# EAGLE design boardV3 (EAGLE 6.4)

## Sheet 1 of 2
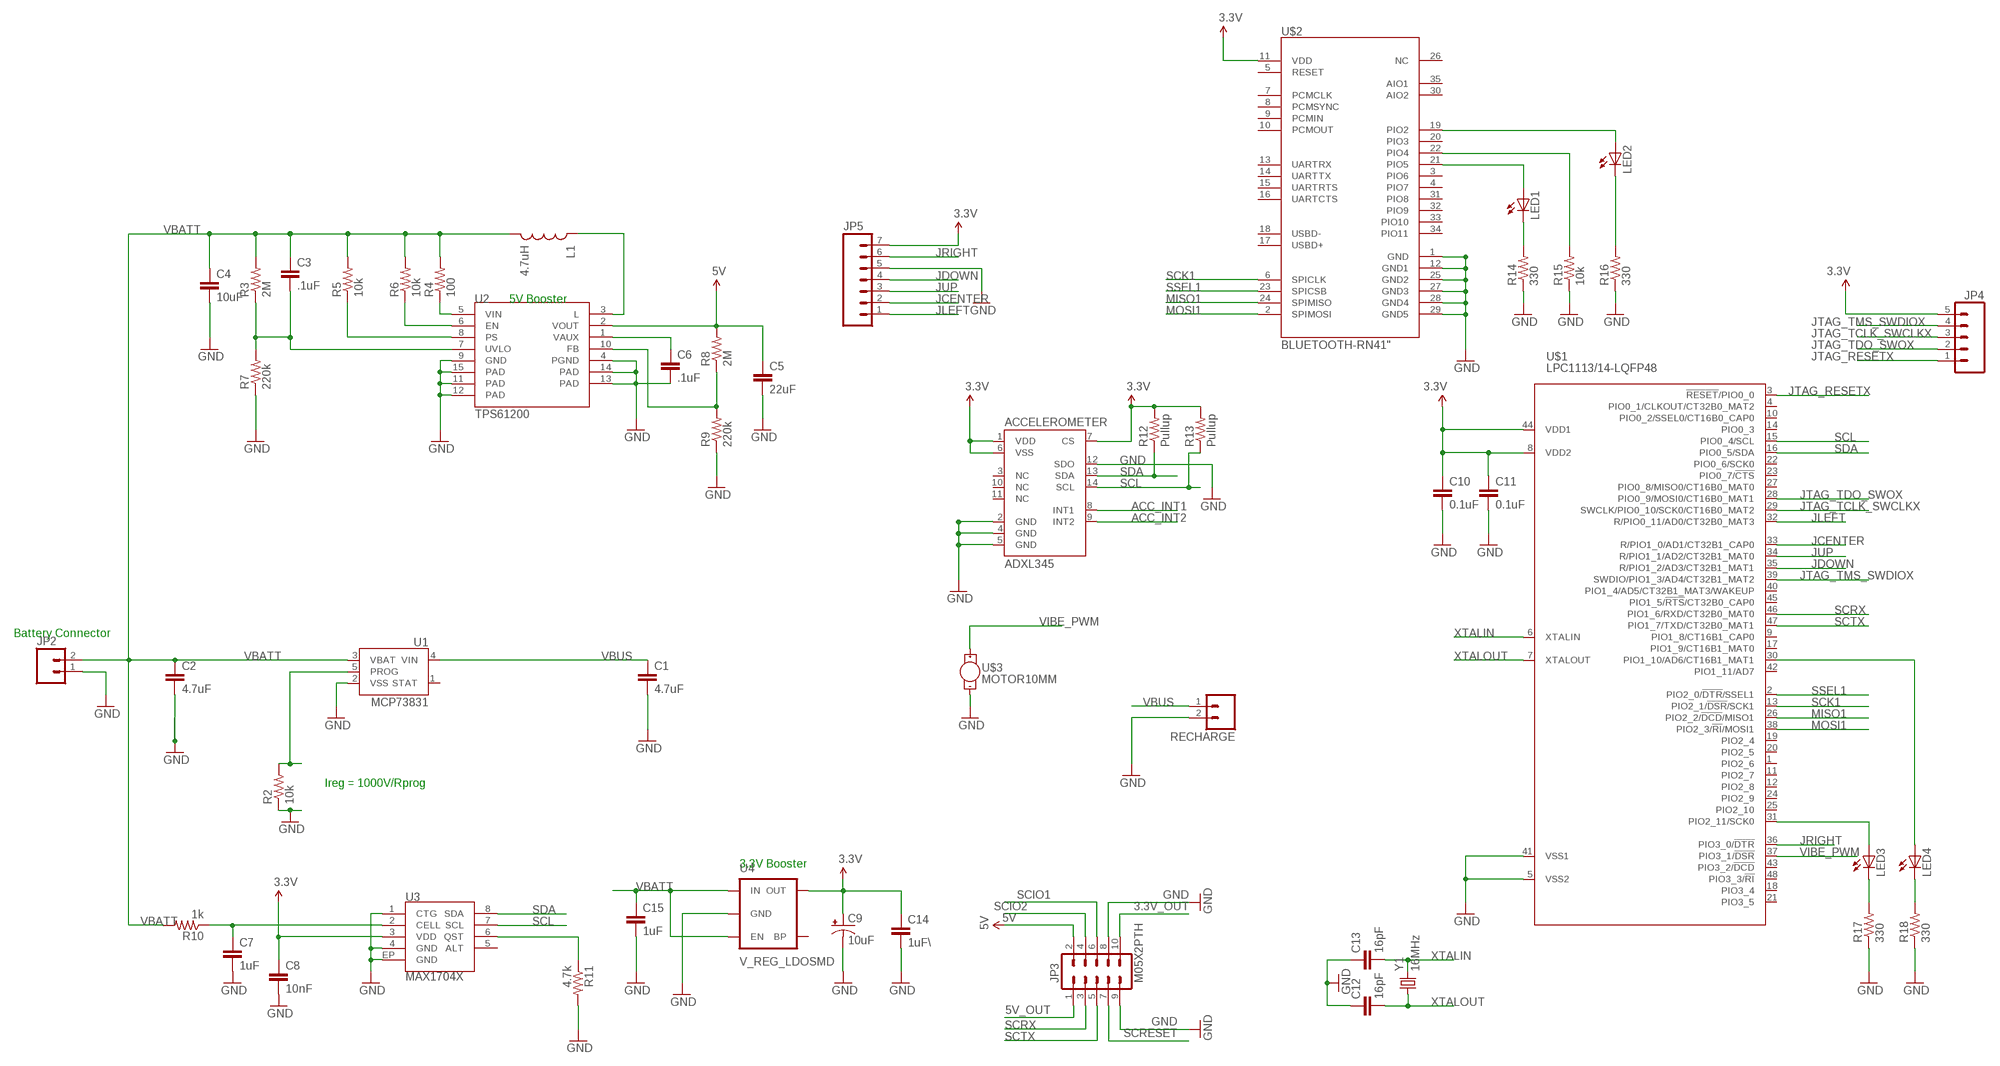
[diagram p0: schematic, sheet 1, part 1 of 2]
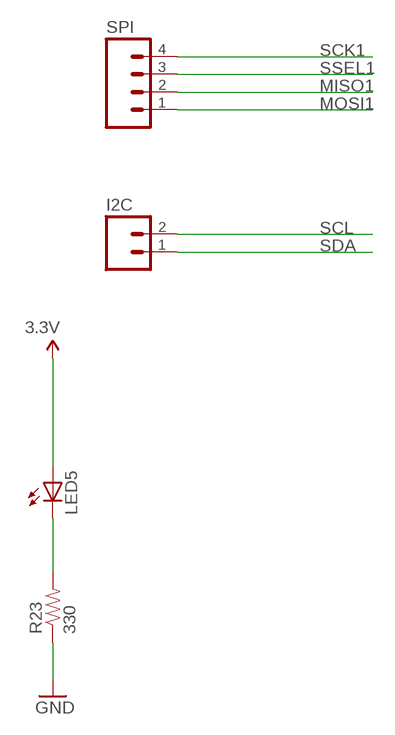
[diagram p1: schematic, sheet 1, part 2 of 2]

### Parts
ACCELEROMETER  ADXL345  [LGA14]
C1  4.7uF  CAP0603-CAP  [0603-CAP]
C2  4.7uF  CAP0603-CAP  [0603-CAP]
C3  .1uF  CAP0603-CAP  [0603-CAP]
C4  10uF  CAP0603-CAP  [0603-CAP]
C5  22uF  CAP0603-CAP  [0603-CAP]
C6  .1uF  CAP0603-CAP  [0603-CAP]
C7  1uF  CAP0603-CAP  [0603-CAP]
C8  10nF  CAP0603-CAP  [0603-CAP]
C9  10uF  10UF-TANT  [EIA3216]
C10  0.1uF  CAP0603-CAP  [0603-CAP]
C11  0.1uF  CAP0603-CAP  [0603-CAP]
C12  16pF  CAP0603-CAP  [0603-CAP]
C13  16pF  CAP0603-CAP  [0603-CAP]
C14  1uF\  CAP0603-CAP  [0603-CAP]
C15  1uF  CAP0603-CAP  [0603-CAP]
I2C  M02POLAR  [MOLEX-1X2]
JP2  M02PTH  [1X02]
JP3  M05X2PTH  [AVR_ICSP]
JP4  M05PTH  [1X05]
JP5  M07  [1X07]
L1  4.7uH  INDUCTOR.  [CDRH2D09]
LED1  LED0603  [LED-0603]
LED2  LED0603  [LED-0603]
LED3  LED0603  [LED-0603]
LED4  LED0603  [LED-0603]
LED5  LED0603  [LED-0603]
R2  10k  RESISTOR0603-RES  [0603-RES]
R3  2M  RESISTOR0603-RES  [0603-RES]
R4  100  RESISTOR0603-RES  [0603-RES]
R5  10k  RESISTOR0603-RES  [0603-RES]
R6  10k  RESISTOR0603-RES  [0603-RES]
R7  220k  RESISTOR0603-RES  [0603-RES]
R8  2M  RESISTOR0603-RES  [0603-RES]
R9  220k  RESISTOR0603-RES  [0603-RES]
R10  1k  RESISTOR0603-RES  [0603-RES]
R11  4.7k  RESISTOR0603-RES  [0603-RES]
R12  Pullup  RESISTOR0603-RES  [0603-RES]
R13  Pullup  RESISTOR0603-RES  [0603-RES]
R14  330  RESISTOR0603-RES  [0603-RES]
R15  10k  RESISTOR0603-RES  [0603-RES]
R16  330  RESISTOR0603-RES  [0603-RES]
R17  330  RESISTOR0603-RES  [0603-RES]
R18  330  RESISTOR0603-RES  [0603-RES]
R23  330  RESISTOR0603-RES  [0603-RES]
RECHARGE  M02POLAR  [MOLEX-1X2]
SPI  M04POLAR  [MOLEX-1X4]
U1  MCP73831  [SOT23-5]
U2  TPS61200  [QFN-10_PAD]
U3  MAX1704X  [TDFN-8]
U4  V_REG_LDOSMD  [SOT23-5]
U$1  LPC1113/14-LQFP48  [LQFP48]
U$2  BLUETOOTH-RN41"  [RN41]
U$3  MOTOR10MM  [VIBE-MOTOR-10MM]
Y1  16MHz  CRYSTAL5X3  [CRYSTAL-SMD-5X3]

### Nets
3.3V: ACCELEROMETER.1(VDD) ACCELEROMETER.6(VSS) ACCELEROMETER.7(CS) C8.1 C9.A(+) C10.1 C11.1 C14.1 JP4.5 JP5.7 LED5.A R12.2 R13.2 U3.3(VDD) U4.5(OUT) U$1.8(VDD2) U$1.44(VDD1) U$2.11(VDD) ; also sheet 2
3.3V_OUT: JP3.10
5V: C5.1 JP3.2 R8.2 U2.2(VOUT)
5V_OUT: JP3.1
ACC_INT1: ACCELEROMETER.8(INT1)
ACC_INT2: ACCELEROMETER.9(INT2)
GND: ACCELEROMETER.2(GND) ACCELEROMETER.4(GND) ACCELEROMETER.5(GND) ACCELEROMETER.12(SDO) C1.2 C2.2 C4.2 C5.2 C6.2 C7.2 C8.2 C9.C(-) C10.2 C11.2 C12.1 C13.1 C14.2 C15.2 JP2.1 JP3.8 JP3.9 JP5.5 R2.1 R7.1 R9.1 R11.2 R14.1 R15.1 R16.1 R17.1 R18.1 R23.1 RECHARGE.2 U1.2(VSS) U2.4(PGND) U2.9(GND) U2.11(PAD) U2.12(PAD) U2.13(PAD) U2.14(PAD) U2.15(PAD) U3.1(CTG) U3.4(GND) U3.EP(GND) U4.2(GND) U$1.5(VSS2) U$1.41(VSS1) U$2.1(GND) U$2.12(GND1) U$2.25(GND2) U$2.27(GND3) U$2.28(GND4) U$2.29(GND5) U$3.- ; also sheet 2
JCENTER: JP5.2 U$1.33(R/PIO1_0/AD1/CT32B1_CAP0) ; also sheet 2
JDOWN: JP5.4 U$1.35(R/PIO1_2/AD3/CT32B1_MAT1) ; also sheet 2
JLEFT: JP5.1 U$1.32(R/PIO0_11/AD0/CT32B0_MAT3) ; also sheet 2
JRIGHT: JP5.6 U$1.36(PIO3_0/!DTR!) ; also sheet 2
JTAG_RESETX: JP4.1 U$1.3(!RESET!/PIO0_0)
JTAG_TCLK_SWCLKX: JP4.3 U$1.29(SWCLK/PIO0_10/SCK0/CT16B0_MAT2)
JTAG_TDO_SWOX: JP4.2 U$1.28(PIO0_9/MOSI0/CT16B0_MAT1)
JTAG_TMS_SWDIOX: JP4.4 U$1.39(SWDIO/PIO1_3/AD4/CT32B1_MAT2)
JUP: JP5.3 U$1.34(R/PIO1_1/AD2/CT32B1_MAT0) ; also sheet 2
MISO1: SPI.2 U$1.26(PIO2_2/!DCD!/MISO1) U$2.24(SPIMISO)
MOSI1: SPI.1 U$1.38(PIO2_3/!RI!/MOSI1) U$2.2(SPIMOSI)
N$1: LED2.A U$2.19(PIO2)
N$2: R2.2 U1.5(PROG)
N$3: C3.2 R3.1 R7.2 U2.7(UVLO)
N$4: C6.1 U2.1(VAUX)
N$5: R6.1 U2.6(EN)
N$6: R5.1 U2.8(PS)
N$7: L1.P$1 U2.3(L)
N$8: R8.1 R9.2 U2.10(FB)
N$9: C7.1 R10.1 U3.2(CELL)
N$10: R11.1 U3.6(QST)
N$11: R15.2 U$2.22(PIO4)
N$12: LED1.A U$2.21(PIO5)
N$13: LED1.C R14.2
N$14: LED2.C R16.2
N$15: LED3.A U$1.31(PIO2_11/SCK0)
N$16: LED4.A U$1.30(PIO1_10/AD6/CT16B1_MAT1)
N$17: LED3.C R17.2
N$18: LED4.C R18.2
N$21: LED5.C R23.2
SCIO1: JP3.6
SCIO2: JP3.4
SCK1: SPI.4 U$1.13(PIO2_1/!DSR!/SCK1) U$2.6(SPICLK)
SCL: ACCELEROMETER.14(SCL) I2C.2 R13.1 U3.7(SCL) U$1.15(PIO0_4/SCL)
SCRESET: JP3.7
SCRX: JP3.3 U$1.46(PIO1_6/RXD/CT32B0_MAT0)
SCTX: JP3.5 U$1.47(PIO1_7/TXD/CT32B0_MAT1)
SDA: ACCELEROMETER.13(SDA) I2C.1 R12.1 U3.8(SDA) U$1.16(PIO0_5/SDA)
SSEL1: SPI.3 U$1.2(PIO2_0/!DTR!/SSEL1) U$2.23(SPICSB)
VBATT: C2.1 C3.1 C4.1 C15.1 JP2.2 L1.P$2 R3.2 R4.2 R5.2 R6.2 R10.2 U1.3(VBAT) U4.1(IN) U4.3(EN)
VBUS: C1.1 RECHARGE.1 U1.4(VIN)
VIBE_PWM: U$1.37(PIO3_1/!DSR!) U$3.+
VIN: R4.1 U2.5(VIN)
XTALIN: C13.2 U$1.6(XTALIN) Y1.3
XTALOUT: C12.2 U$1.7(XTALOUT) Y1.1
Unconnected: ACCELEROMETER.3(NC) ACCELEROMETER.10(NC) ACCELEROMETER.11(NC) U1.1(STAT) U3.5(ALT) U4.4(BP) U$1.1(PIO2_6) U$1.4(PIO0_1/CLKOUT/CT32B0_MAT2) U$1.9(PIO1_8/CT16B1_CAP0) U$1.10(PIO0_2/SSEL0/CT16B0_CAP0) U$1.11(PIO2_7) U$1.12(PIO2_8) U$1.14(PIO0_3) U$1.17(PIO1_9/CT16B1_MAT0) U$1.18(PIO3_4) U$1.19(PIO2_4) U$1.20(PIO2_5) U$1.21(PIO3_5) U$1.22(PIO0_6/SCK0) U$1.23(PIO0_7/!CTS!) U$1.24(PIO2_9) U$1.25(PIO2_10) U$1.27(PIO0_8/MISO0/CT16B0_MAT0) U$1.40(PIO1_4/AD5/CT32B1_MAT3/WAKEUP) U$1.42(PIO1_11/AD7) U$1.43(PIO3_2/!DCD!) U$1.45(PIO1_5/!RTS!/CT32B0_CAP0) U$1.48(PIO3_3/!RI!) U$2.3(PIO6) U$2.4(PIO7) U$2.5(RESET) U$2.7(PCMCLK) U$2.8(PCMSYNC) U$2.9(PCMIN) U$2.10(PCMOUT) U$2.13(UARTRX) U$2.14(UARTTX) U$2.15(UARTRTS) U$2.16(UARTCTS) U$2.17(USBD+) U$2.18(USBD-) U$2.20(PIO3) U$2.26(NC) U$2.30(AIO2) U$2.31(PIO8) U$2.32(PIO9) U$2.33(PIO10) U$2.34(PIO11) U$2.35(AIO1)

### Notes on the sheet
- 5V Booster
- Battery Connector
- Ireg = 1000V/Rprog
- 3.3V Booster

## Sheet 2 of 2
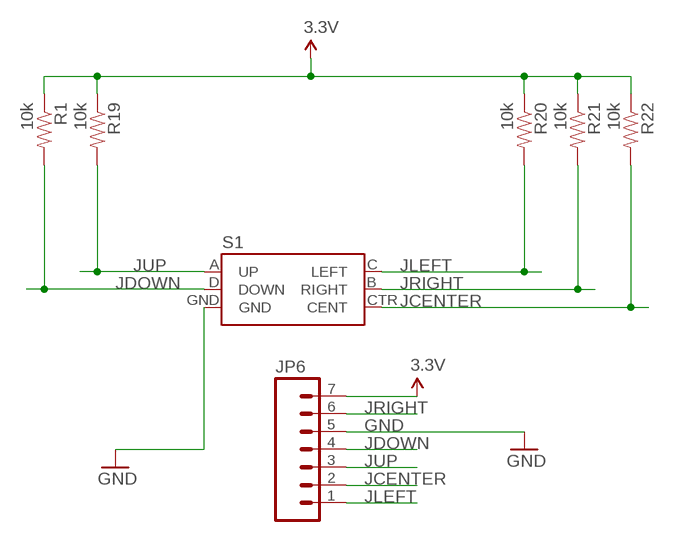
[diagram p2: schematic, sheet 2]

### Parts
JP6  M07  [1X07]
R1  10k  RESISTOR0603-RES  [0603-RES]
R19  10k  RESISTOR0603-RES  [0603-RES]
R20  10k  RESISTOR0603-RES  [0603-RES]
R21  10k  RESISTOR0603-RES  [0603-RES]
R22  10k  RESISTOR0603-RES  [0603-RES]
S1  JOYSTICK_MINI  [JOYSTICK_MINI]

### Nets
3.3V: JP6.7 R1.1 R19.1 R20.1 R21.1 R22.1 ; also sheet 1
GND: JP6.5 S1.GND ; also sheet 1
JCENTER: JP6.2 R22.2 S1.CTR(CENT) ; also sheet 1
JDOWN: JP6.4 R1.2 S1.D(DOWN) ; also sheet 1
JLEFT: JP6.1 R20.2 S1.C(LEFT) ; also sheet 1
JRIGHT: JP6.6 R21.2 S1.B(RIGHT) ; also sheet 1
JUP: JP6.3 R19.2 S1.A(UP) ; also sheet 1

## Library data of the parts
ACCELEROMETER = SparkFun-Sensors:ADXL345: 3-axis SPI/I2C 2/4/8/16g accelerometer
C1-C8 C10-C15 = SparkFun-Passives:CAP: Capacitor Standard 0603 ceramic capacitor, and 0.1" leaded capacitor.
C9 = SparkFun-Capacitors:10UF-TANT: 10uF Tantalum SMT CAP-00811- 16V 10% (EIA-3216); PROD_ID: CAP-00811
I2C JP2 RECHARGE = SparkFun-Connectors:M02: Header 2 Standard 2-pin 0.1" header. Use with straight break away headers (SKU : PRT-00116), right angle break away headers (PRT-00553), swiss pins (PRT-00743), machine pins (PRT-00117), and female headers (PRT-00115). Molex polarized connector foot print use with SKU : PRT-08233 with associated crimp pins and housings.
JP3 = SparkFun-Connectors:M05X2: Header 5x2 Standard 10-pin dual row 0.1" header. Commonly used with AVR-ISP. Use with Spark Fun Electronics SKU: PRT-00778
JP4 = SparkFun-Connectors:M05: Header 5 Standard 5-pin 0.1" header. Use with straight break away headers (SKU : PRT-00116), right angle break away headers (PRT-00553), swiss pins (PRT-00743), machine pins (PRT-00117), and female headers (PRT-00115). Molex polarized connector foot print use with SKU : PRT-08230 with associated crimp pins and housings.
JP5 JP6 = SparkFun-Connectors:M07: Header 7 Standard 7-pin 0.1" header. Use with straight break away headers (SKU : PRT-00116), right angle break away headers (PRT-00553), swiss pins (PRT-00743), machine pins (PRT-00117), and female headers (PRT-00115). NOTES ON THE VARIANTS LOCK and LOCK_LONGPADS... This footprint was designed to help hold the alignment of a through-hole component (i.e. 7-pin header) while soldering it into place. You may notice that each hole has been shifted either up or down by 0.005 of an inch from it's more standard position (which is usually a perfectly straight line). This slight alteration caused the pins (the squares in the middle) to touch the edges of the holes. Because they are alternating, it causes a "brace" to hold the header in place. 0.005 has proven to be the perfect amount of "off-center" position when using our standard breakaway headers. Although looks a little odd when you look at the bare footprint, once you have a header in there, the alteration is very hard to notice. Also, if you push a header all the way into place, it is covered up entirely on the bottom side. This idea of altering the position of holes to aid alignment will be further integrated into the Sparkfun Library for other footprints. It can help hold any component with 3 or more connection pins.
L1 = SparkFun-Passives:INDUCTOR: Inductors Basic Inductor/Choke - 0603 and 1206. Footprints are not proven and vary greatly between part numbers.
LED1-LED5 = SparkFun-LED:LED: LEDs Standard schematic elements and footprints for 5mm, 3mm, 1206, and 0603 sized LEDs. 5mm - Spark Fun Electronics SKU : COM-00529 (and others)
R1 R8 R9 R12 R13 R19-R22 = SparkFun-Resistors:RESISTOR: Resistor Basic schematic elements and footprints for 0603, 1206, and PTH resistors.
R2-R7 R10 R11 R14-R18 R23 = SparkFun-Passives:RESISTOR: Resistor Basic schematic elements and footprints for 0603, 1206, and PTH resistors.
S1 = SparkFun-Electromechanical:JOYSTICK_MINI: Small 5-way tactile joystick, COM-10063 4UCON SF303GJ26
SPI = SparkFun-Connectors:M04: Header 4 Standard 4-pin 0.1" header. Use with straight break away headers (SKU : PRT-00116), right angle break away headers (PRT-00553), swiss pins (PRT-00743), machine pins (PRT-00117), and female headers (PRT-00115). Molex polarized connector foot print use with SKU : PRT-08231 with associated crimp pins and housings. 1MM SMD Version SKU: PRT-10208
U1 = SparkFun-PowerIC:MCP73831: Miniature single cell, fully integrated Li-Ion, Li-polymer charge management controller http://ww1.microchip.com/downloads/en/DeviceDoc/21984a.pdf IC-09995; PROD_ID: IC-09995
U2 = SparkFun-PowerIC:TPS61200: DC to DC Booster IC-10035; PROD_ID: IC-10035
U3 = SparkFun-PowerIC:MAX1704X: MAX17043/MAX17044: Battery Fuel Guage (43 is 1cell, 44 is 2cell)
U4 = SparkFun-PowerIC:V_REG_LDO: Voltage Regulator LDO Standard 150mA LDO voltage regulator in SOT-23 layout. Micrel part MIC5205. BP (by-pass) pin is used to lower output noise with 470pF cap.
U$1 = lpc1100v1.1:LPC1113/14-LQFP48: NXP Semiconductors LPC11xx microcontrollers <http://ics.nxp.com/products/lpc1000/lpc11xx/> ARM 32-bit Cortex-M0 Microcontroller with MPU CPU clock up to 50MHz Up to 32KByte on-chip Flash ROM with In-System Programming (ISP) and In-Application Programming (IAP) via On-Chip Bootloader Up to 8KByte SRAM Nested Vectored Interrupt Controller Up to 2 SPI controllers UART with full Modem Interface and RS485 Support Fast Mode I2C-Bus 4 Timers with 4 capture channels and 13 output channels Watchdog (WDT) Sytem tick timer 10-bit ADC with 8 channels Power Management Unit (PMU) Brownout detection 12MHz internal RC oscillator Serial Wire Debug/Trace port
U$2 = SparkFun-RF:BLUETOOTH-RN41: Bluetooth SMD module
U$3 = SparkFun-Electromechanical:MOTOR: Vibration Motor- ROB-08449 Physical dimension and wire connections for this powerful vibration motor. Motor has a self adhesive backing.
Y1 = SparkFun-FreqCtrl:CRYSTAL: Various standard crystals. Proven footprints. Spark Fun Electronics SKU : COM-00534

## Board
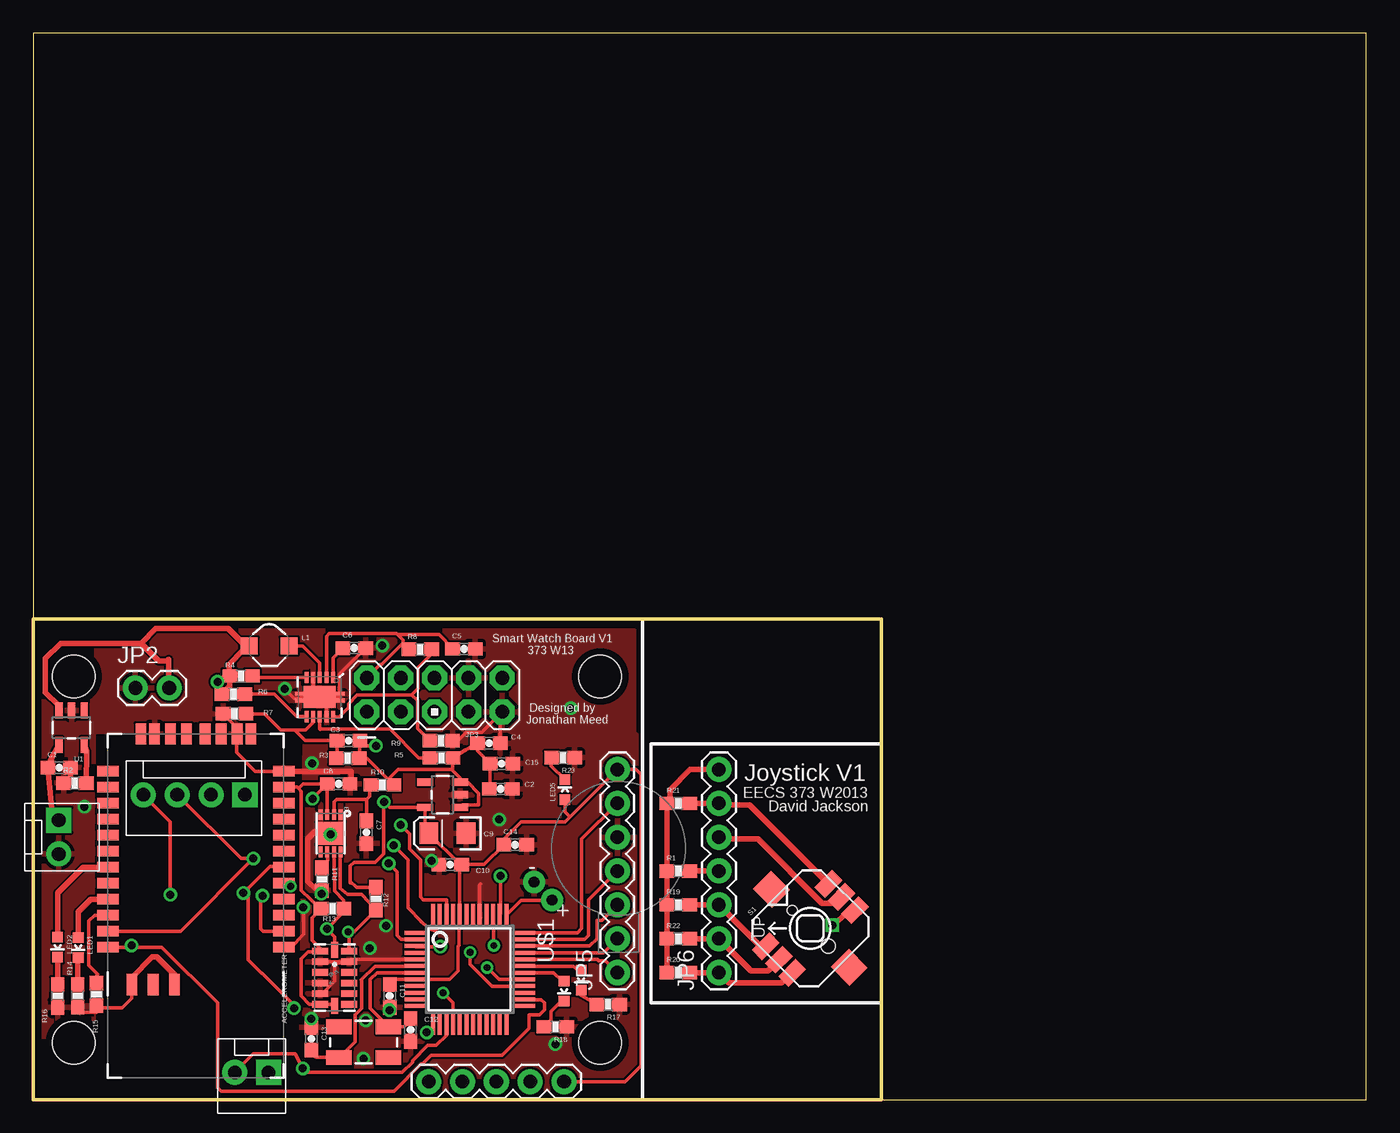
[diagram p3: board, top side]
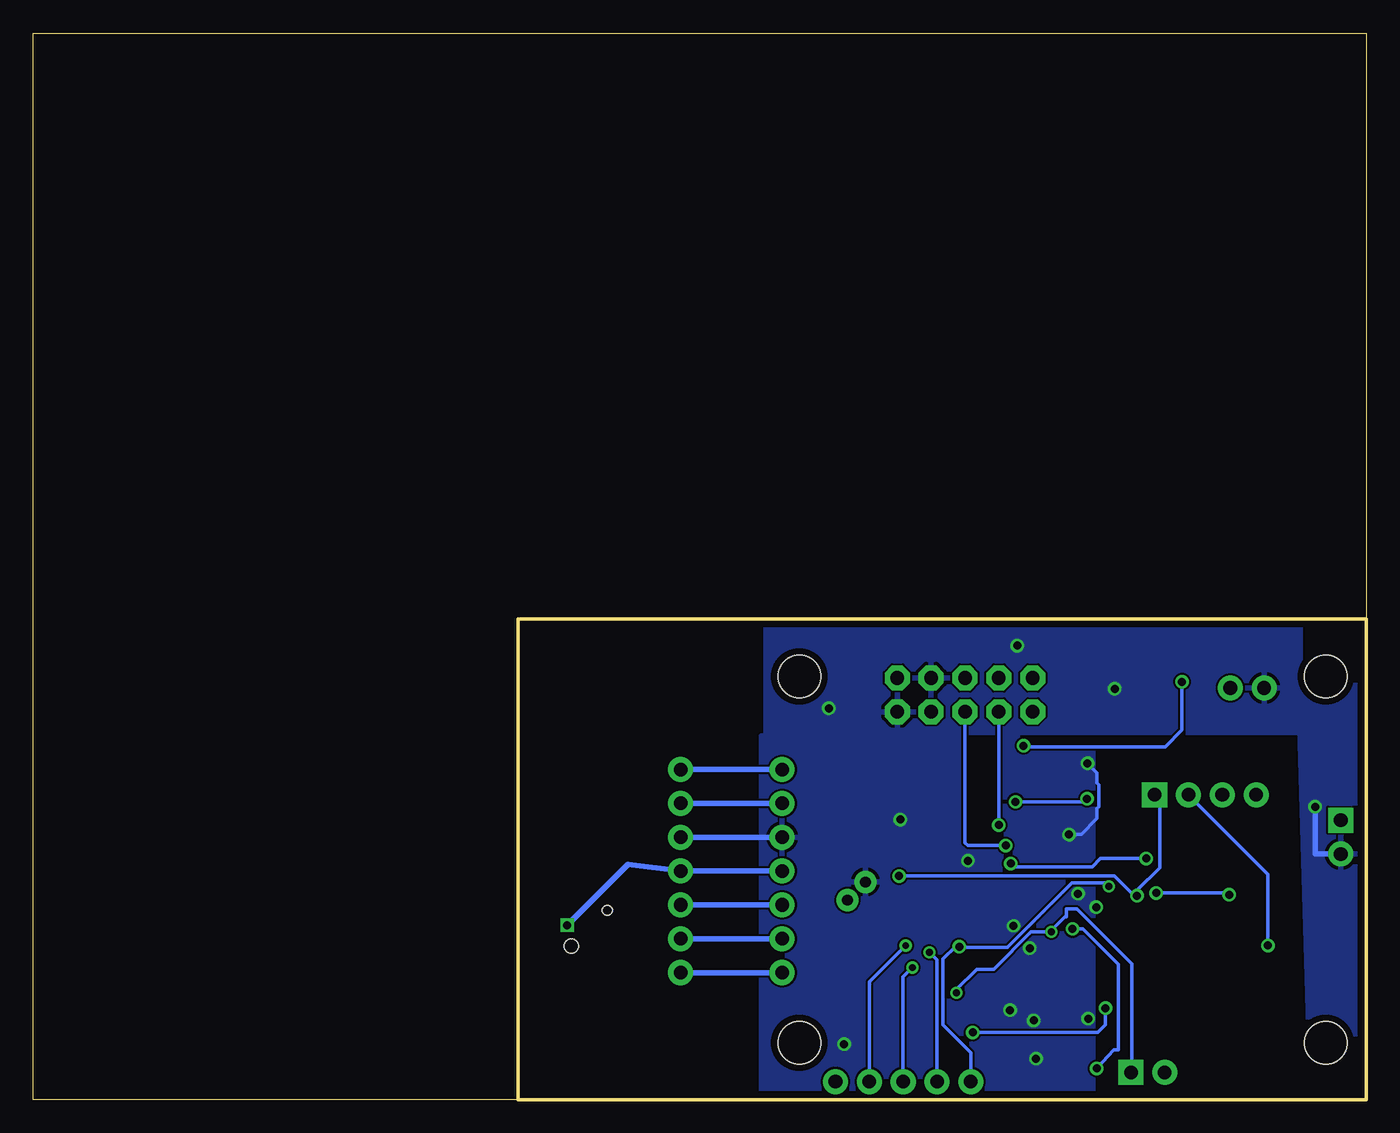
[diagram p4: board, bottom side, seen from below]

Size 100 x 80 mm. Coordinates in mm from the lower left corner, seen from the top.
Outline: 63.5,0 63.47,0 0,0 0,36.07
Outline: 63.5,0 100,0 100,80 0,80 0,36.07
Outline: 0,36.07 63.47,36.07
Outline: 63.5,0 63.63,0 63.63,36.07
Copper layers (1*16): Top 0.0178mm / dielectric 59mil / Bottom 0.0178mm
Design rules "default": minimum track width 6mil, minimum drill 14mil, track to track 6mil, track to pad 6mil, pad to pad 6mil, via to via 6mil, smd to smd 6mil, copper to edge 20mil, drill to drill 16mil, minimum pad ring 8mil, minimum via ring 8mil, stop-mask expansion 3mil, vias tented up to drill 0mil, thermal gap 10mil
Holes 3.2 mm at 42.53,31.75 3.03,31.75 3.03,4.25 42.53,4.25

### Footprints (pad centres in the part's own frame; a part is rotated, then mirrored left to right if it is on the bottom)
LGA14 = smd 0.5 x 1.2: 1 2,1.1; 2 1.2,1.1; 3 0.4,1.1; 4 -0.4,1.1; 5 -1.2,1.1; 6 -2,1.1; 8 -2,-1.1; 9 -1.2,-1.1; 10 -0.4,-1.1; 11 0.4,-1.1; 12 1.2,-1.1; 13 2,-1.1 | smd 1.2 x 0.5: 7 -2.1,0; 14 2.1,0
0603-CAP = smd 1.1 x 1: 1 -0.85,0; 2 0.85,0
EIA3216 = smd 1.4 x 1.6: A 1.4,0; C -1.4,0
MOLEX-1X2 = drill 1.016 pad 1.88 square: 1 0,0 | drill 1.016 pad 1.88: 2 2.54,0
1X02 = drill 1.016 pad 1.88: 1 0,0; 2 2.54,0
AVR_ICSP = drill 1.016 pad 1.88 octagon: 1 -1.27,5.08; 2 1.27,5.08; 3 -1.27,2.54; 4 1.27,2.54; 5 -1.27,0; 6 1.27,0; 7 -1.27,-2.54; 8 1.27,-2.54; 9 -1.27,-5.08; 10 1.27,-5.08
1X05 = drill 1.016 pad 1.88: 1 0,0; 2 2.54,0; 3 5.08,0; 4 7.62,0; 5 10.16,0
1X07 = drill 1.016 pad 1.88: 1 0,0; 2 2.54,0; 3 5.08,0; 4 7.62,0; 5 10.16,0; 6 12.7,0; 7 15.24,0
CDRH2D09 = smd 1.3 x 1.3: P$1 -1.5,0; P$2 1.5,0
LED-0603 = smd 0.8 x 0.8: A 0,-0.75; C 0,0.75
0603-RES = smd 1.1 x 1: 1 -0.85,0; 2 0.85,0
JOYSTICK_MINI = smd 1.85 x 1.1: A -3.325,1.4; B 3.325,1.4; C -3.325,-1.4; CTR -3.325,0; D 3.325,-1.4; GND 3.325,0 | smd 1.9 x 2: NC 0,4.13; NC@0 0,-4.13 | hole 0.75: 0,1.9 | hole 1.05: 0,-1.9
MOLEX-1X4 = drill 1.016 pad 1.88 square: 1 0,0 | drill 1.016 pad 1.88: 2 2.54,0; 3 5.08,0; 4 7.62,0
SOT23-5 = smd 0.55 x 1.2: 1 -0.95,-1.3; 2 0,-1.3; 3 0.95,-1.3; 4 0.95,1.3; 5 -0.95,1.3
QFN-10_PAD = smd 0.297 x 0.85: 1 -1,-1.475; 2 -0.5,-1.475; 3 0,-1.475; 4 0.5,-1.475; 5 1,-1.475; 6 1,1.475; 7 0.5,1.475; 8 0,1.475; 9 -0.5,1.475; 10 -1,1.475 | smd 0.7 x 0.28: 11 -1.5,0.25; 12 -1.5,-0.25; 13 1.5,0.25; 14 1.5,-0.25 | smd 2.4 x 1.65: 15 0,0
TDFN-8 = smd 0.8 x 0.3: 1 -1.4,0.75; 2 -1.4,0.25; 3 -1.4,-0.25; 4 -1.4,-0.75; 5 1.4,-0.75; 6 1.4,-0.25; 7 1.4,0.25; 8 1.4,0.75 | smd 1.73 x 1.88: EP 0,0
LQFP48 = smd 0.3 x 1.6: 1 -2.75,-4.1; 2 -2.25,-4.1; 3 -1.75,-4.1; 4 -1.25,-4.1; 5 -0.75,-4.1; 6 -0.25,-4.1; 7 0.25,-4.1; 8 0.75,-4.1; 9 1.25,-4.1; 10 1.75,-4.1; 11 2.25,-4.1; 12 2.75,-4.1; 25 2.75,4.1; 26 2.25,4.1; 27 1.75,4.1; 28 1.25,4.1; 29 0.75,4.1; 30 0.25,4.1; 31 -0.25,4.1; 32 -0.75,4.1; 33 -1.25,4.1; 34 -1.75,4.1; 35 -2.25,4.1; 36 -2.75,4.1 | smd 1.6 x 0.3: 13 4.1,-2.75; 14 4.1,-2.25; 15 4.1,-1.75; 16 4.1,-1.25; 17 4.1,-0.75; 18 4.1,-0.25; 19 4.1,0.25; 20 4.1,0.75; 21 4.1,1.25; 22 4.1,1.75; 23 4.1,2.25; 24 4.1,2.75; 37 -4.1,2.75; 38 -4.1,2.25; 39 -4.1,1.75; 40 -4.1,1.25; 41 -4.1,0.75; 42 -4.1,0.25; 43 -4.1,-0.25; 44 -4.1,-0.75; 45 -4.1,-1.25; 46 -4.1,-1.75; 47 -4.1,-2.25; 48 -4.1,-2.75
RN41 = smd 0.8 x 1.6: 1 -6.6,-6.6; 2 -5.4,-6.6; 3 -4.2,-6.6; 4 -3,-6.6; 5 -1.8,-6.6; 6 -0.6,-6.6; 7 0.6,-6.6; 8 1.8,-6.6; 9 3,-6.6; 10 4.2,-6.6; 11 5.4,-6.6; 12 6.6,-6.6; 13 6.6,6.6; 14 5.4,6.6; 15 4.2,6.6; 16 3,6.6; 17 1.8,6.6; 18 0.6,6.6; 19 -0.6,6.6; 20 -1.8,6.6; 21 -3,6.6; 22 -4.2,6.6; 23 -5.4,6.6; 24 -6.6,6.6 | smd 1.6 x 0.8: 25 -9.4,4.8; 26 -9.4,3.2; 27 -9.4,1.6; 28 9.4,3.1; 29 9.4,-3.1; 30 9.4,-4.122; 31 9.4,-1.9; 32 9.4,-0.7; 33 9.4,0.7; 34 9.4,1.9; 35 9.4,4.122
VIBE-MOTOR-10MM = drill 0.8 pad 1.676: + -5,-3.9; - -6.35,-2.54
CRYSTAL-SMD-5X3 = smd 1.9 x 1.1: 1 -1.85,-1.15; 2 1.85,-1.15; 3 1.85,1.15; 4 -1.85,1.15

### Placement (x,y rotation side)
ACCELEROMETER  22.61,9.15 90 top
C1  1.95,24.9 0 top
C2  35.07,23.3 0 top
C3  23.64,26.93 180 top
C4  34.18,26.73 0 top
C5  32.31,33.8 0 top
C6  24.09,33.87 0 top
C7  24.98,20.06 270 top
C8  22.9,23.68 0 top
C9  31.07,19.98 180 top
C10  31.28,17.63 180 top
C11  26.74,7.77 270 top
C12  28.3,5.22 90 top
C13  20.87,4.57 270 top
C14  36.16,19.11 0 top
C15  35.12,25.2 0 top
I2C  17.65,2.03 180 top
JP2  7.65,30.88 0 top
JP3  30.1,30.36 90 top
JP4  29.66,1.35 0 top
JP5  43.81,9.53 90 top
JP6  51.44,9.53 90 top
L1  17.69,34.03 180 top
LED1  3.36,11.41 180 top
LED2  1.82,11.44 180 top
LED3  41.1,8.97 180 top
LED4  39.82,8.14 180 top
LED5  39.88,23.24 0 top
R1  48.39,17.14 0 top
R2  3.12,23.74 0 top
R3  23.59,25.61 0 top
R4  15.59,31.78 180 top
R5  30.62,25.63 0 top
R6  15.01,30.41 180 top
R7  15.09,28.94 0 top
R8  29.03,33.78 180 top
R9  30.59,26.92 180 top
R10  26.19,23.6 0 top
R11  21.66,16.53 270 top
R12  25.71,15.06 90 top
R13  22.45,14.32 180 top
R14  3.33,7.79 90 top
R15  4.74,7.9 90 top
R16  1.83,7.77 90 top
R17  43.13,7.13 180 top
R18  39.17,5.46 180 top
R19  48.39,14.61 0 top
R20  48.39,9.53 0 top
R21  48.39,22.23 0 top
R22  48.39,12.06 0 top
R23  39.75,25.65 180 top
RECHARGE  1.91,20.95 270 top
S1  58.29,12.85 45 top
SPI  15.88,22.86 180 top
U1  2.86,27.9 180 top
U2  21.49,30.19 180 top
U3  22.31,19.98 270 top
U4  30.71,22.87 90 top
U$1  32.74,9.76 270 top
U$2  12.19,18.03 90 top
U$3  43.92,18.86 0 top
Y1  24.78,4.31 180 top

### Tracks (layer width: path | path; a pad name or v marks a point on that pad's centre or on a via)
3.3V  (via drill 0.6)
  Top 0.254: ACCELEROMETER.7 22.51,7.14 ACCELEROMETER.6 20.7,7.14 20.08,7.77 20.08,10.54 20.61,11.06 21.43,11.06 ACCELEROMETER.1 | ACCELEROMETER.1 21.51,11.06 21.55,11.01 | ACCELEROMETER.1 21.51,11.35 20.92,11.94 20.92,13.65 R13.2 21.48,14.32 20.79,15.02 | 19.89,23.34 20.11,23.13 20.11,15.7 20.79,15.02 | 19.89,23.34 19.79,23.45 18.81,23.45 U$2.11 | C8.1 U3.3 | C8.1 20.23,23.68 19.89,23.34 | v20.95,22.57 v20.95,22.58 C8.1 | C9.A 29.41,20.24 U4.5 26.72,21.92 v26.31,22.33 26.27,22.29 26.27,18.42 25.64,17.79 24.06,17.79 23.79,17.52 23.79,16.38 | 30,19.65 C9.A | C10.1 32.2,17.63 | 32.2,17.63 32.2,17.62 | C10.1 32.02,17.63 C9.A | 23.79,16.26 23.79,16.38 | C11.1 27.13,9.01 U$1.8 31.24,9.01 31.88,9.65 31.88,11.5 31.95,11.57 31.95,13.82 U$1.44 31.99,17.49 C10.1 | 32.2,17.63 33.82,17.63 C14.1 35.31,19.56 36.58,20.83 39.88,20.83 40.26,21.21 | 40.26,21.21 JP5.7 45.21,24.77 45.59,24.38 45.59,2.54 44.4,1.35 JP4.5 | LED5.A 39.88,21.59 40.26,21.21 | 20.79,15.02 | R12.2 24.25,15.91 23.79,16.38
  Top 0.406: JP6.7 49.28,24.77 47.75,23.24 47.75,22.44 R21.1 R1.1 R19.1 R22.1 R20.1
  Bottom 0.254: v26.31,22.33 21.18,22.33 v20.95,22.57
  Bottom 0.406: JP5.7 JP6.7
5V
  Top 0.254: U2.2 21.99,34.76 22.2,34.97 27.27,34.97 27.38,34.85 | 27.38,34.85 27.75,34.48 27.75,34.27 27.59,34.11 | 27.59,34.11 26.12,32.64 26.03,32.64 JP3.2 | R8.2 27.93,33.78 27.59,34.11 | C5.1 31.46,33.86 30.44,34.88 27.41,34.88 27.38,34.85
GND  (via drill 0.6)
  Top 0.254: ACCELEROMETER.5 21.67,7.95 22.61,8.88 22.61,10.14 22.71,10.25 23.61,10.25 ACCELEROMETER.12 | ACCELEROMETER.12 ACCELEROMETER.2 | 18.79,25.01 U$2.12 16.64,24.63 15.24,26.04 15.24,27.38 U$2.29 15.53,27.68 15.51,27.68 R7.1 | U$1.5 23.88,10.51 ACCELEROMETER.12 | U$2.25 7.39,7.59 6.67,6.87 4.92,6.87 R15.1 4.74,6.54 3.33,6.54 R14.1 3.65,6.62 | U$2.1 19.34,11.43 20.29,12.38 20.29,14.38 v20.25,14.43 | 33.49,13.75 U$1.41 33.49,16.11 33.54,16.16 | 33.49,13.75 33.51,13.73 | 33.49,13.75 33.49,13.69 33.55,13.63 | U2.12 22.99,31.93 C6.2 | C4.2 35.03,28.94 JP3.9 33.65,27.56 32.48,27.56 31.84,26.92 R9.1 | U2.4 20.99,30.69 | U2.9 21.99,29.95 21.84,30.1 19.56,30.1 18.92,30.73 18.8,30.73 | C11.2 26.74,6.72 v26.72,6.7
  Top 0.406: U$2.25 7.39,9.14 8.94,10.69 9.26,10.69 10.63,9.32 10.63,8.68 U$2.27 | 3.44,7.03 R14.1 | C1.2 2.75,23.78 R2.1 | U$2.12 23.82,24.63 23.83,24.63 23.83,23.76 C8.2 | 20.99,30.69 U2.15 | U2.15 20.24,30.19 U2.13 | U2.15 22.74,30.19 U2.12 | JP6.5 51.44,19.56 54.36,19.56 59.18,14.73 60.18,14.73 S1.GND | R11.2 21.28,15.68 20.57,16.38 20.57,19.56 21.14,20.13 22.16,20.13 U3.EP
  Bottom 0.254: v22.3,19.89 21.39,19.89 20.19,21.08 20.19,21.84 20.07,21.97 20.07,23.62 20.19,23.75 20.19,24.51 v20.9,25.22
  Bottom 0.406: JP5.5 JP6.5 | RECHARGE.2 3.83,18.41 v3.83,21.97
  other vias: 26.45,13.03 40.32,29.35 20.86,6.06 24.77,3.07 24.94,5.94 25.25,11.36 26.18,34.05 29.88,17.92 34.96,21.01 18.87,30.81 39.16,4.16 21.63,15.45
  pour Bottom: 4.94,35.45 45.05,35.45 45.05,27.55 4.94,27.55 4.94,32.8
  pour Top: 4.81,35.21 45.03,35.21 45.03,27.61 4.58,27.61
  pour Top: 0.45,35.3 4.49,35.3 4.49,0.4 0.58,0.4 0.58,1.35
  pour Top: 20.4,27.34 45.21,27.34 45.21,0.81 20.09,0.81 20.09,2.47
  pour Bottom: 0.47,35.61 5.19,35.61 4.16,0.31 0.62,0.31 0.62,0.52
  pour Bottom: 20.58,27.29 45.36,27.29 45.36,0.31 21.61,0.31 21.61,0.57 20.52,0.57 20.52,27.24
JCENTER
  Top 0.254: U$1.33 42.76,11.01 JP5.2
  Top 0.406: R22.2 JP6.2 53.85,9.65 55.12,9.65 55.94,10.48 S1.CTR
  Bottom 0.406: JP5.2 JP6.2
JDOWN  (via drill 0.6)
  Top 0.254: U$1.35 41.35,12.01 41.66,12.32 41.66,14.99 JP5.4
  Top 0.406: S1.D 61.61,14.21 61.59,14.22 61.34,14.22 v59.94,13.08 | JP6.4 R1.2
  Bottom 0.406: v59.94,13.08 55.37,17.65 JP6.4 JP5.4
JLEFT
  Top 0.254: U$1.32 42.32,10.51 42.42,10.41 42.93,10.41 JP5.1
  Top 0.406: R20.2 JP6.1 52.2,8.76 56.13,8.76 56.88,9.5 S1.C
  Bottom 0.406: JP5.1 JP6.1
JRIGHT
  Top 0.254: U$1.36 40.84,12.51 41.15,12.83 41.15,19.56 JP5.6
  Top 0.406: R21.2 JP6.6 51.56,22.1 53.74,22.1 S1.B
  Bottom 0.406: JP5.6 JP6.6
JTAG_RESETX  (via drill 0.51, 0.6)
  Top 0.254: v30.53,11.47 28.68,11.47 U$1.3 | 19.07,16.23 v19.3,16
  Bottom 0.254: JP4.1 29.66,3.5 31.75,5.59 31.75,10.54 30.82,11.47 v30.53,11.47 30.49,11.43 26.92,11.43 22.1,16.26 19.56,16.26 v19.3,16
JTAG_TCLK_SWCLKX  (via drill 0.51)
  Top 0.254: v34.04,9.91 34.92,9.02 U$1.29
  Bottom 0.254: JP4.3 34.74,9.2 v34.04,9.91
JTAG_TDO_SWOX  (via drill 0.51)
  Top 0.254: v32.77,11.05 32.77,10.16 34.42,8.51 U$1.28
  Bottom 0.254: JP4.2 32.2,10.48 v32.77,11.05
JTAG_TMS_SWDIOX  (via drill 0.51)
  Top 0.254: v34.54,11.56 34.54,13.81 U$1.39
  Bottom 0.254: JP4.4 37.28,8.82 v34.54,11.56
JUP
  Top 0.254: U$1.34 41.74,11.51 42.29,12.06 42.29,13.46 42.67,13.46 JP5.3
  Top 0.406: R19.2 JP6.3 54.56,11.48 S1.A
  Bottom 0.406: JP5.3 JP6.3
MISO1  (via drill 0.6)
  Top 0.254: U$1.26 36.86,7.49 38.1,7.49 38.35,7.24 38.35,6.73 37.97,6.35 37.21,6.35 37.21,5.33 35.18,3.3 29.84,3.3 29.21,2.67 29.08,2.67 27.05,0.64 14.1,0.64 13.84,0.89 13.84,7.24 9.65,11.43 7.49,11.43 | U$2.24 7.49,11.43 | 7.49,11.43 v7.37,11.56
  Bottom 0.254: v7.37,11.56 7.37,16.89 SPI.2
MOSI1  (via drill 0.6)
  Top 0.254: U$2.2 17.23,12.63 17.04,12.82 17.04,15.14 v17.19,15.29 | v35.05,16.78 35.05,13.92 U$1.38
  Bottom 0.254: v35.05,16.78 35.04,16.77 18.89,16.77 17.41,15.29 v17.19,15.29 17.19,15.7 15.49,17.4 15.49,22.48 SPI.1
N$1
  Top 0.406: LED2.A 1.82,15.49 3.76,17.43 U$2.19
N$2
  Top 0.406: R2.2 3.99,26.12 U1.5
N$3
  Top 0.254: R7.2 17.35,28.94 18.57,27.72 19.6,27.72 | R3.1 22.79,25.66 C3.2 20.39,26.93 19.6,27.72 | U2.7 20.99,28.29 20.42,27.72 19.6,27.72
N$4
  Top 0.254: U2.1 22.49,33.13 C6.1
N$5
  Top 0.254: R6.1 18.07,30.41 19.22,29.26 19.25,29.26 19.76,28.75 20.46,28.75 U2.6
N$6
  Top 0.254: U2.8 21.49,27.82 21.54,27.78 21.56,27.8 26.75,27.8 28.92,25.63 R5.1
N$7
  Top 0.254: L1.P$1 20.2,34.03 21.46,32.77 21.46,31.7 U2.3
N$8
  Top 0.254: U2.10 22.96,28.72 23.64,29.4 23.64,29.7 24.31,30.37 28.39,30.37 | 28.39,30.37 28.81,29.95 28.81,27.85 R9.2 | 28.39,30.37 28.88,30.85 28.88,32.43 29.88,33.43 R8.1
N$9
  Top 0.254: U3.2 22.55,22.32 22.75,22.52 24.93,22.52 | 24.93,22.52 25.02,22.43 25.02,20.95 C7.1 | 24.93,22.52 25,22.52 25.23,22.74 25.23,23.59 R10.1
N$10
  Top 0.254: R11.1 21.79,17.65 22.08,17.94 22.08,18.56 U3.6
N$11
  Top 0.254: U$2.22 4.59,13.83 4.15,13.39 4.15,10.06 4.83,9.38 4.74,9.29 R15.2
N$12
  Top 0.406: LED1.A 3.36,14.07 4.3,15.01 5.56,15.01 U$2.21
N$13
  Top 0.406: R14.2 3.33,10.62 LED1.C
N$14
  Top 0.406: R16.2 LED2.C
N$15
  Top 0.254: LED3.A 40.82,9.72 40.53,10.01 U$1.31
N$16
  Top 0.254: LED4.A 39.65,8.89 39.04,9.51 U$1.30
N$17
  Top 0.254: LED3.C 41.1,7.8 R17.2
N$18
  Top 0.254: LED4.C 39.62,7.39 38.84,6.61 38.84,5.98 R18.2
N$21
  Top 0.254: LED5.C 39.88,24 38.86,25.02 38.86,25.61 R23.2
SCK1  (via drill 0.6)
  Top 0.254: U$1.13 29.99,5.51 v29.51,5.03 | v19.55,6.85 19.55,7.09 17.15,9.48 17.13,9.48 16.13,10.48 16.13,15.84 | U$2.6 18.73,17.49 17.79,17.49 16.13,15.84 | 16.13,15.84 16.1,15.84 v15.75,15.49 | v10.29,15.37 10.29,20.83 SPI.4
  Bottom 0.254: v29.51,5.03 20.13,5.03 19.55,5.61 v19.55,6.85 | v15.75,15.49 10.41,15.49 v10.29,15.37
SCL  (via drill 0.6)
  Top 0.254: U3.7 22.59,15.65 23.3,14.95 R13.1 23.3,14.07 v22.03,12.8 22.61,12.22 ACCELEROMETER.14 | U$1.15 | 30.96,5.63 U$1.15 | I2C.2 16.51,3.43 19.64,3.43 v20.22,2.34 20.53,2.03 27.69,2.03 28.45,2.79 28.45,2.92 29.59,4.06 30.23,4.06 30.99,4.83 U$1.15
  Bottom 0.254: v22.03,12.8 21.26,12.8 18.6,10.14 18.6,3.74 18.95,3.74 v20.22,2.34
SCRX  (via drill 0.6)
  Top 0.254: U$1.46 30.99,14.99 29.26,14.99 29.05,15.21 29.05,17.99 28.23,18.81 28.23,19.93 v27.56,20.6
  Bottom 0.254: v27.56,20.6 JP3.3
SCTX  (via drill 0.6)
  Top 0.254: U$1.47 30.49,12.97 30.16,12.64 29.8,12.77 29.11,13.33 29.15,13.33 28.12,14.36 28.12,17.98 v27.05,19.05
  Bottom 0.254: v27.05,19.05 29.9,19.05 30.11,19.26 JP3.5
SDA  (via drill 0.51)
  Top 0.254: 23.68,11.17 ACCELEROMETER.13 23.71,12.49 v23.62,12.57 24.07,12.57 R12.1 24.64,15.41 23.58,15.41 23.03,15.83 23.03,18.56 U3.8 | U$1.16 31.49,7.25 v30.73,8
  Bottom 0.254: I2C.1 17.57,2.11 17.57,10.17 21.71,14.31 22.48,14.31 22.48,13.72 22.6,13.72 23.62,12.7 v23.62,12.57 25.15,12.57 27.94,9.78 29.21,9.78 30.73,8.26 v30.73,8
SSEL1  (via drill 0.6)
  Top 0.254: U$2.23 11.06,12.63 v16.5,18.07 15.58,18.07 SPI.3 | 26.67,17.58 v26.67,17.71 27.3,17.07 27.3,12.32 27.59,12.03 28.62,12.03 U$1.2
  Bottom 0.254: v16.5,18.07 19.93,18.07 20.55,17.45 26.41,17.45 v26.67,17.71
VBATT  (via drill 0.6)
  Top 0.254: 15.3,31.87 14.35,31.87 v13.81,31.34 | v25.7,26.54 24.88,26.54 C3.1 24.49,25.66 R3.2 25.03,25.61 26.62,24.02 | 26.62,24.02 R10.2 | 31.47,24.69 31.4,24.76 27.36,24.76 26.62,24.02 | 31.47,24.69 R5.2 32.44,26.22 C4.1 33.33,26.14 C15.1 34.27,23.35 C2.1 | 31.47,24.69 32.01,24.15 U4.3 32.57,23.82 33.4,22.99 33.4,22.1 32.18,22.1 U4.1
  Top 0.406: U1.3 1.91,29.55 0.91,30.55 0.91,33.1 2.05,34.24 8.08,34.24 | 8.08,34.24 9.41,32.91 10.05,32.91 10.16,33.02 10.16,30.91 JP2.2 | 15.75,34.03 L1.P$2 15.96,34.03 | 15.3,31.87 R4.2 | 8.08,34.24 9.2,35.35 14.63,35.35 15.75,34.23 15.75,34.03 | 15.75,34.03 15.75,33.73 14.68,32.66 14.68,31.84 R4.2 | R4.2 14.74,30.99 R6.2
  Bottom 0.254: v13.81,31.34 13.81,27.74 15.09,26.47 25.63,26.47 v25.7,26.54
VBUS
  Top 0.406: U1.4 1.45,25.83 C1.1 1.45,21.1 1.59,20.95 RECHARGE.1
VIBE_PWM
  Top 0.254: U$3.+ 36.59,14.96 U$1.37
VIN
  Top 0.254: U2.5 16.55,31.67
  Top 0.406: 16.55,31.67 R4.1
XTALIN
  Top 0.254: Y1.3 23.29,3.16 | U$1.6 25.63,10.01 24.58,8.96 24.64,8.91 24.64,6.86 24.13,6.35 24.13,4.32 22.97,3.16 Y1.3 | Y1.3 21.21,3.16 C13.2
XTALOUT
  Top 0.254: C12.2 28.18,5.99 28.18,5.83 27.81,5.46 26.67,5.46 | 26.67,5.46 Y1.1 | 26.67,5.46 25.27,6.86 25.27,9.02 25.78,9.53 28.63,9.53 U$1.7

### Text on the board
tNames: Smart Watch Board V1 | 373 W13 | Designed by | Jonathan Meed | Joystick V1 | EECS 373 W2013 | David Jackson